# EAGLE design CNC LED (EAGLE 7.2.0)
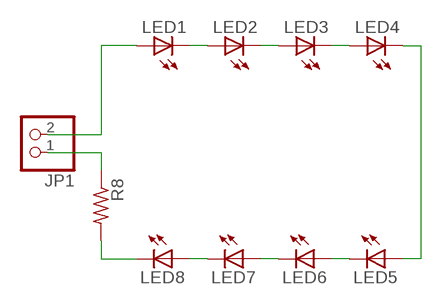
[diagram p0: schematic, sheet 1]

## Parts
JP1  PINHD-1X2  [1X02]
LED1  LEDCHIPLED_1206  [CHIPLED_1206]
LED2  LEDCHIPLED_1206  [CHIPLED_1206]
LED3  LEDCHIPLED_1206  [CHIPLED_1206]
LED4  LEDCHIPLED_1206  [CHIPLED_1206]
LED5  LEDCHIPLED_1206  [CHIPLED_1206]
LED6  LEDCHIPLED_1206  [CHIPLED_1206]
LED7  LEDCHIPLED_1206  [CHIPLED_1206]
LED8  LEDCHIPLED_1206  [CHIPLED_1206]
R8  R-US_R1206  [R1206]

## Nets
N$1: LED1.C LED2.A
N$2: JP1.1 R8.1
N$3: LED2.C LED3.A
N$4: LED3.C LED4.A
N$5: LED8.C R8.2
N$6: LED4.C LED5.A
N$7: LED5.C LED6.A
N$8: LED6.C LED7.A
N$9: LED7.C LED8.A
N$11: JP1.2 LED1.A

## Library data of the parts
JP1 = pinhead:PINHD-1X2: PIN HEADER
LED1-LED8 = adafruit:LED: LED OSRAM: - CHIPLED LG R971, LG N971, LY N971, LG Q971, LY Q971, LO R971, LY R971 LH N974, LH R974 LS Q976, LO Q976, LY Q976 LO Q996 - Hyper CHIPLED LW Q18S LB Q993, LB Q99A, LB R99A - SideLED LS A670, LO A670, LY A670, LG A670, LP A670 LB A673, LV A673, LT A673, LW A673 LH A674 LY A675 LS A676, LA A676, LO A676, LY A676, LW A676 LS A679, LY A679, LG A679 - Hyper Micro SIDELED® LS Y876, LA Y876, LO Y876, LY Y876 LT Y87S - SmartLED LW L88C, LW L88S LB L89C, LB L89S, LG L890 LS L89K, LO L89K, LY L89K LS L896, LA L896, LO L896, LY L896 - TOPLED LS T670, LO T670, LY T670, LG T670, LP T670 LSG T670, LSP T670, LSY T670, LOP T670, LYG T670 LG T671, LOG T671, LSG T671 LB T673, LV T673, LT T673, LW T673 LH T674 LS T676, LA T676, LO T676, LY T676, LB T676, LH T676, LSB T676, LW T676 LB T67C, LV T67C, LT T67C, LS T67K, LO T67K, LY T67K, LW E67C LS E67B, LA E67B, LO E67B, LY E67B, LB E67C, LV E67C, LT E67C LW T67C LS T679, LY T679, LG T679 LS T770, LO T770, LY T770, LG T770, LP T770 LB T773, LV T773, LT T773, LW T773 LH T774 LS E675, LA E675, LY E675, LS T675 LS T776, LA T776, LO T776, LY T776, LB T776 LHGB T686 LT T68C, LB T68C - Hyper Mini TOPLED® LB M676 - Mini TOPLED Santana® LG M470 LS M47K, LO M47K, LY M47K Source: http://www.osram.convergy.de/
R8 = adafruit:R-US_: RESISTOR, American symbol

## Board
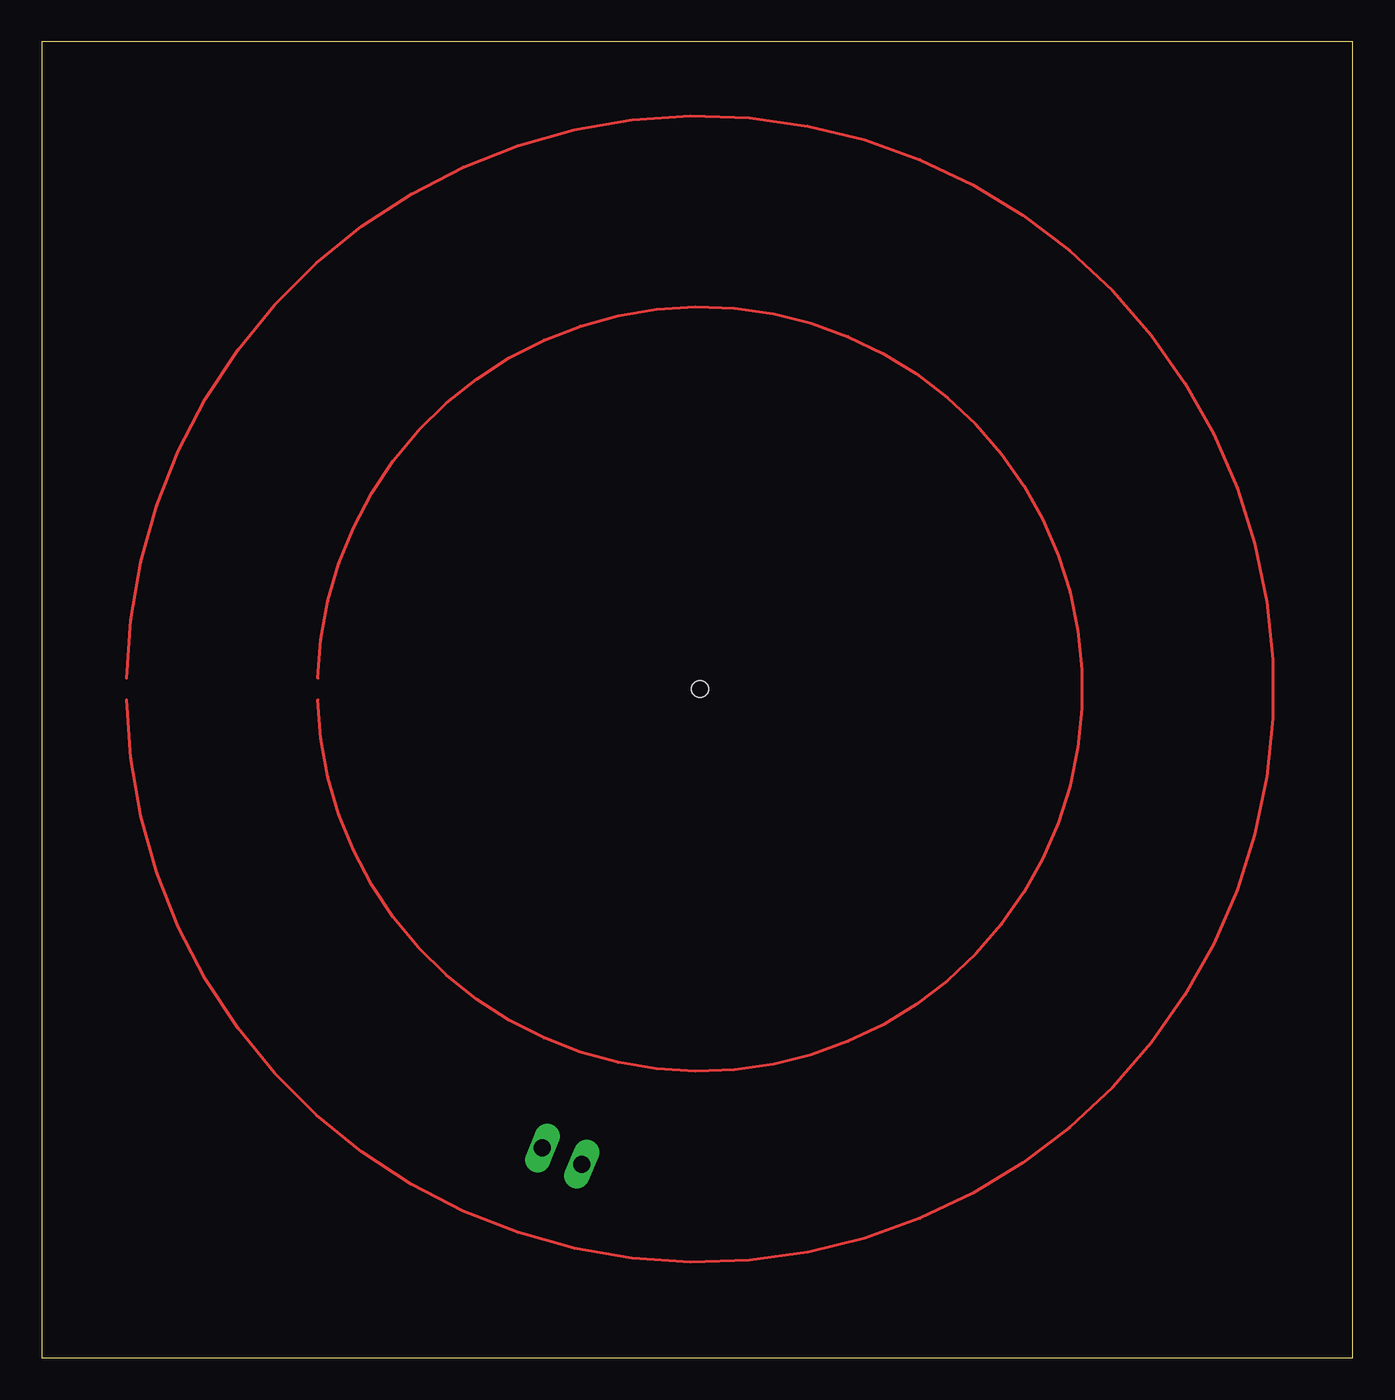
[diagram p1: board, top side]
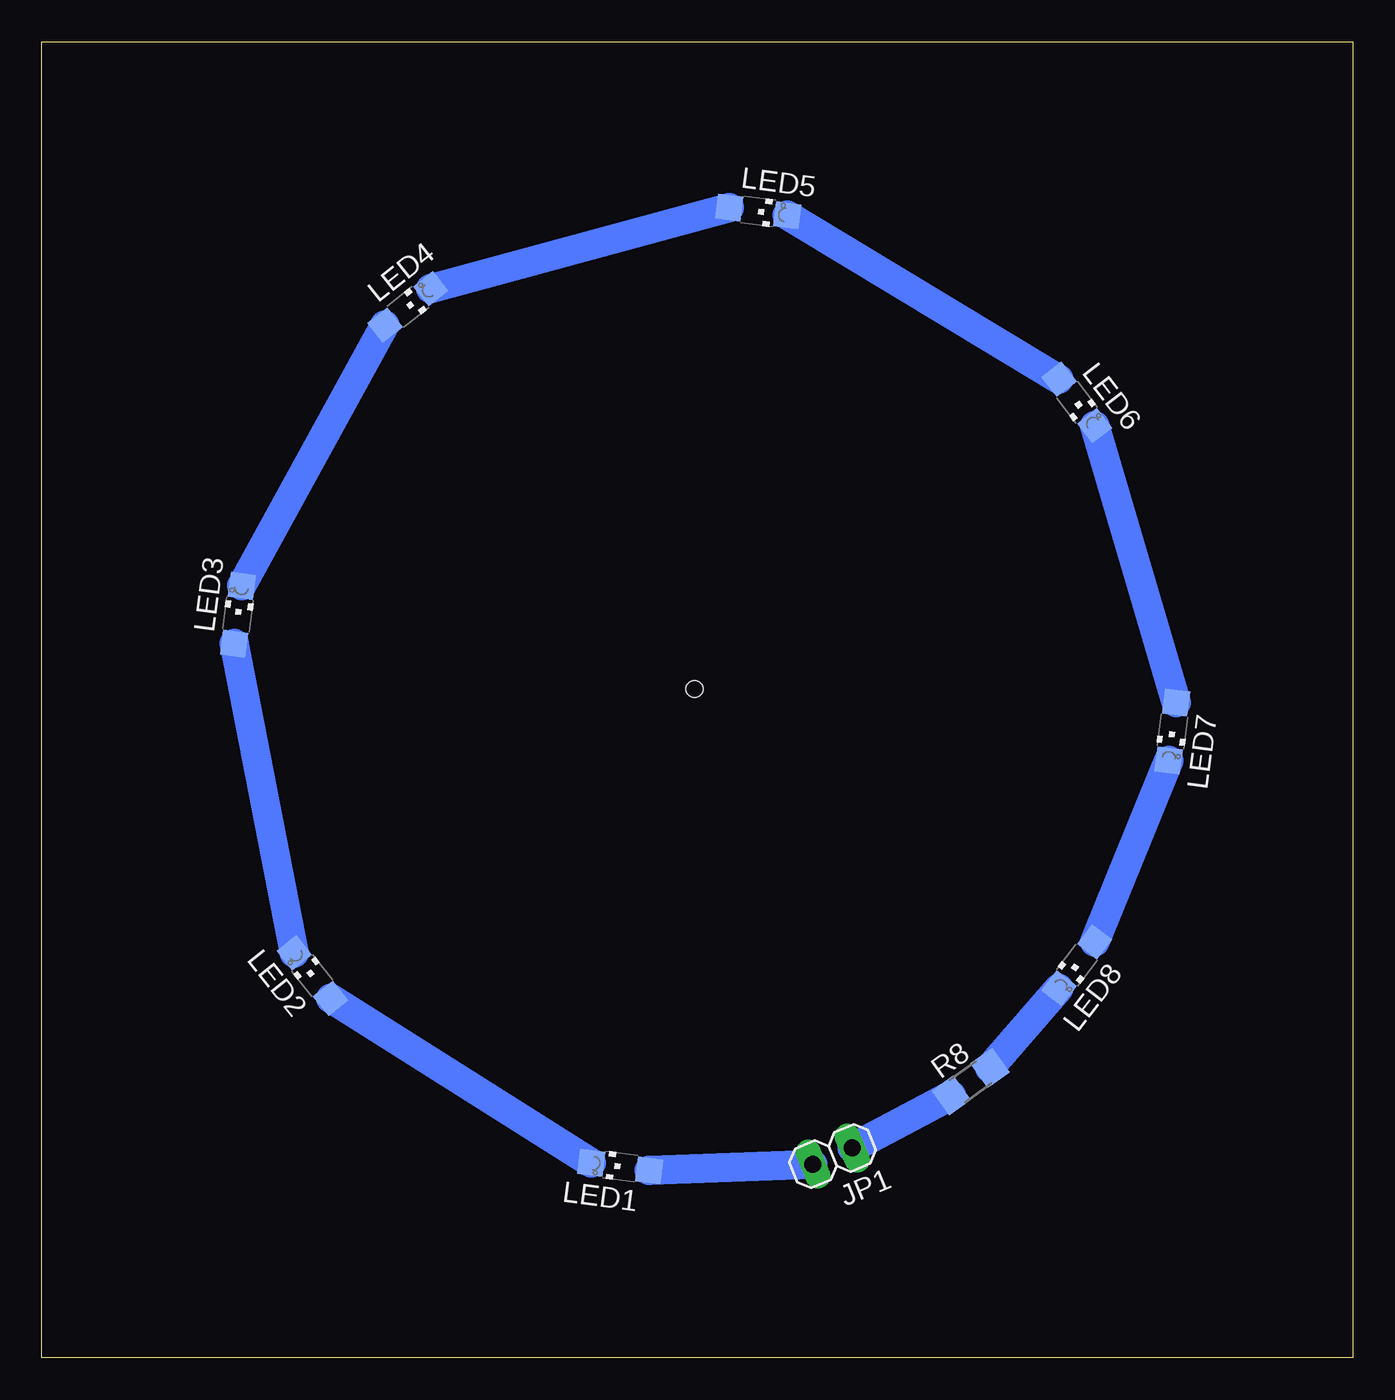
[diagram p2: board, bottom side, seen from below]

Size 78.41 x 78.73 mm. Coordinates in mm from the lower left corner, seen from the top.
Outline: 0,0 78.41,0 78.41,78.73 0,78.73 0,0
Copper layers (1*16): Top 0.035mm / dielectric 1.5mm / Bottom 0.035mm
Design rules "default": minimum track width 10mil, minimum drill 24mil, track to track 8mil, track to pad 8mil, pad to pad 8mil, via to via 8mil, smd to smd 8mil, copper to edge 40mil, drill to drill 8mil, minimum pad ring 10mil, minimum via ring 8mil, stop-mask expansion 4mil, vias tented up to drill 0mil, thermal gap 10mil
Holes 1 mm at 39.37,40.01

### Footprints (pad centres in the part's own frame; a part is rotated, then mirrored left to right if it is on the bottom)
1X02 = drill 1.016 long: 1 -1.27,0; 2 1.27,0
CHIPLED_1206 = smd 1.5 x 1.5: A 0,-1.75; C 0,1.75
R1206 = smd 1.6 x 1.803: 1 -1.422,0; 2 1.422,0

### Placement (x,y rotation side)
JP1  31.11,12.06 202.5 bottom
LED1  43.81,11.43 82.5 bottom
LED2  62.23,22.86 38.5 bottom
LED3  66.67,44.45 352.5 bottom
LED4  56.52,62.87 308.5 bottom
LED5  35.56,68.58 262.5 bottom
LED6  16.51,57.15 217.5 bottom
LED7  10.79,37.47 172.5 bottom
LED8  16.51,23.5 142.5 bottom
R8  22.86,16.51 35.5 bottom

### Tracks (layer width: path | path; a pad name or v marks a point on that pad's centre or on a via)
N$1
  Bottom 1.778: LED1.C LED2.A
N$2
  Bottom 1.778: JP1.1 R8.1
N$3
  Bottom 1.778: LED3.A LED2.C
N$4
  Bottom 1.778: LED4.A LED3.C
N$5
  Bottom 1.778: R8.2 LED8.C
N$6
  Bottom 1.778: LED5.A LED4.C
N$7
  Bottom 1.778: LED6.A LED5.C
N$8
  Bottom 1.778: LED7.A LED6.C
N$9
  Bottom 1.778: LED8.A LED7.C
N$11
  Bottom 1.778: JP1.2 LED1.A
N$15
  Top 0.178: 5.08,40.64 arc-358 5.08,39.37
N$16
  Top 0.178: 16.51,40.64 arc-357 16.51,39.37